# EAGLE design haptic-extender (EAGLE 5.12)
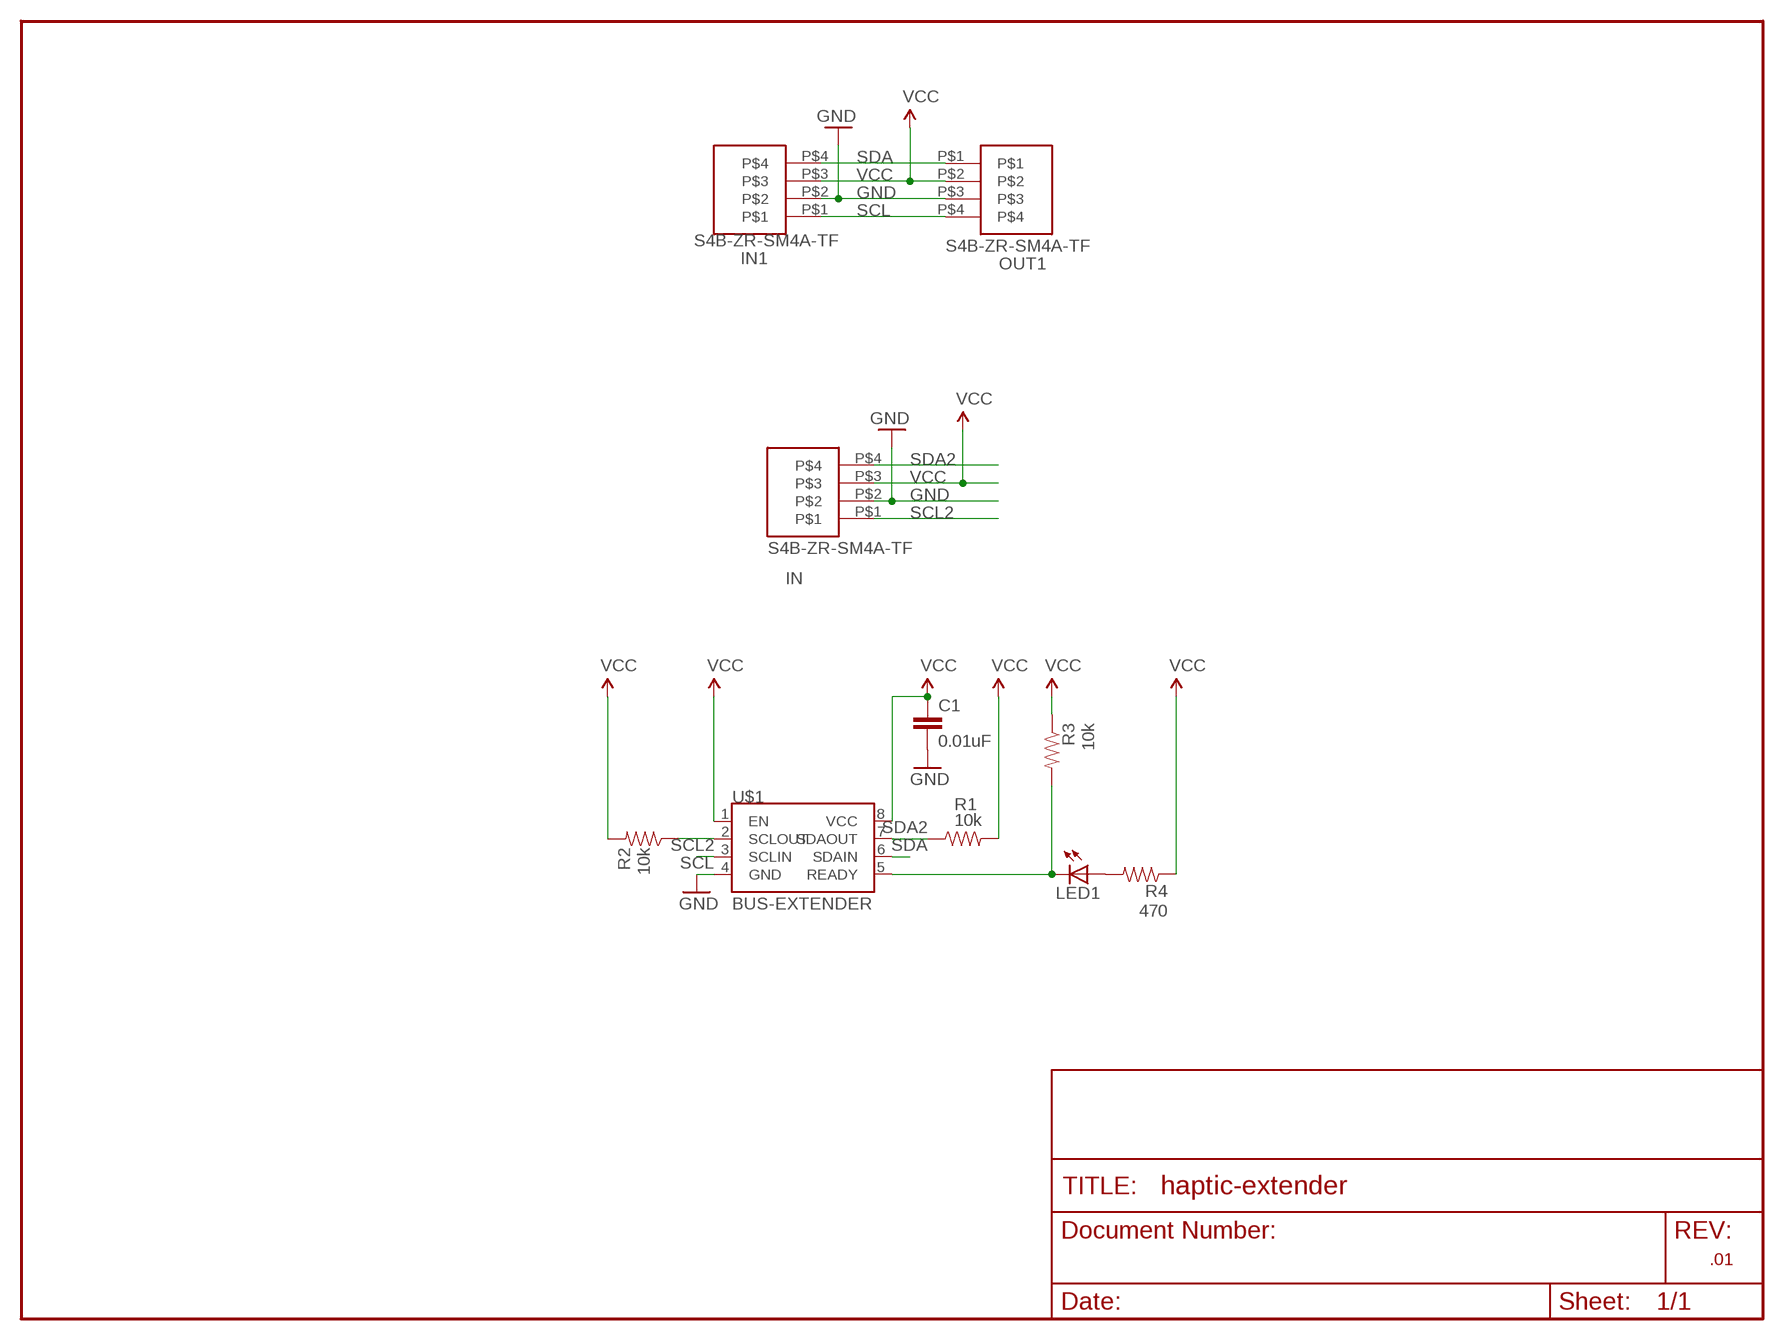
[diagram p0: schematic, sheet 1]

## Parts
C1  0.01uF  CAP0805  [0805]
IN  S4B-ZR-SM4A-TF  [S4B-ZR-SM4A-TF]
IN1  S4B-ZR-SM4A-TF  [S4B-ZR-SM4A-TF]
LED1  LEDCHIP-LED0805  [CHIP-LED0805]
OUT1  S4B-ZR-SM4A-TF  [S4B-ZR-SM4A-TF]
R1  10k  RESISTOR0805-RES  [0805]
R2  10k  RESISTOR0805-RES  [0805]
R3  10k  RESISTOR0805-RES  [0805]
R4  470  RESISTOR0805-RES  [0805]
U$1  BUS-EXTENDER  [SO08]

## Nets
GND [bus]: C1.2 IN1.P$2 IN.P$2 OUT1.P$3 U$1.4(GND)
N$1: LED1.C R3.2 U$1.5(READY)
N$2: LED1.A R4.2
SCL [bus]: IN1.P$1 OUT1.P$4 U$1.3(SCLIN)
SCL2: IN.P$1 R2.1 U$1.2(SCLOUT)
SDA [bus]: IN1.P$4 OUT1.P$1 U$1.6(SDAIN)
SDA2: IN.P$4 R1.1 U$1.7(SDAOUT)
VCC [bus]: C1.1 IN1.P$3 IN.P$3 OUT1.P$2 R1.2 R2.2 R3.1 R4.1 U$1.1(EN) U$1.8(VCC)

## Notes on the sheet
- .01

## Library data of the parts
C1 = SparkFun:CAP: Capacitor Standard 0603 ceramic capacitor, and 0.1" leaded capacitor.
IN IN1 OUT1 = cubic:S4B-ZR-SM4A-TF: B4B-ZR-SM4-TF JST ZH 4pin side entry solder tab
LED1 = led:LED: LED OSRAM: - CHIPLED LG R971, LG N971, LY N971, LG Q971, LY Q971, LO R971, LY R971 LH N974, LH R974 LS Q976, LO Q976, LY Q976 LO Q996 - Hyper CHIPLED LW Q18S LB Q993, LB Q99A, LB R99A - SideLED LS A670, LO A670, LY A670, LG A670, LP A670 LB A673, LV A673, LT A673, LW A673 LH A674 LY A675 LS A676, LA A676, LO A676, LY A676, LW A676 LS A679, LY A679, LG A679 - Hyper Micro SIDELED® LS Y876, LA Y876, LO Y876, LY Y876 LT Y87S - SmartLED LW L88C, LW L88S LB L89C, LB L89S, LG L890 LS L89K, LO L89K, LY L89K LS L896, LA L896, LO L896, LY L896 - TOPLED LS T670, LO T670, LY T670, LG T670, LP T670 LSG T670, LSP T670, LSY T670, LOP T670, LYG T670 LG T671, LOG T671, LSG T671 LB T673, LV T673, LT T673, LW T673 LH T674 LS T676, LA T676, LO T676, LY T676, LB T676, LH T676, LSB T676, LW T676 LB T67C, LV T67C, LT T67C, LS T67K, LO T67K, LY T67K, LW E67C LS E67B, LA E67B, LO E67B, LY E67B, LB E67C, LV E67C, LT E67C LW T67C LS T679, LY T679, LG T679 LS T770, LO T770, LY T770, LG T770, LP T770 LB T773, LV T773, LT T773, LW T773 LH T774 LS E675, LA E675, LY E675, LS T675 LS T776, LA T776, LO T776, LY T776, LB T776 LHGB T686 LT T68C, LB T68C - Hyper Mini TOPLED® LB M676 - Mini TOPLED Santana® LG M470 LS M47K, LO M47K, LY M47K Source: http://www.osram.convergy.de LUXEON: - LUMILED® LXK2-PW12-R00, LXK2-PW12-S00, LXK2-PW14-U00, LXK2-PW14-V00 LXK2-PM12-R00, LXK2-PM12-S00, LXK2-PM14-U00 LXK2-PE12-Q00, LXK2-PE12-R00, LXK2-PE12-S00, LXK2-PE14-T00, LXK2-PE14-U00 LXK2-PB12-K00, LXK2-PB12-L00, LXK2-PB12-M00, LXK2-PB14-N00, LXK2-PB14-P00, LXK2-PB14-Q00 LXK2-PR12-L00, LXK2-PR12-M00, LXK2-PR14-Q00, LXK2-PR14-R00 LXK2-PD12-Q00, LXK2-PD12-R00, LXK2-PD12-S00 LXK2-PH12-R00, LXK2-PH12-S00 LXK2-PL12-P00, LXK2-PL12-Q00, LXK2-PL12-R00 Source: www.luxeon.com KINGBRIGHT: KA-3528ASYC Source: www.kingbright.com
R1-R4 = SparkFun:RESISTOR: Resistor Basic schematic elements and footprints for 0603, 1206, and PTH resistors.
U$1 = jjr:BUS-EXTENDER: I2c Bus extender based on TCA4311A

## Net classes
1 bus: width 0.406 mm, drill 0.406 mm

## Board
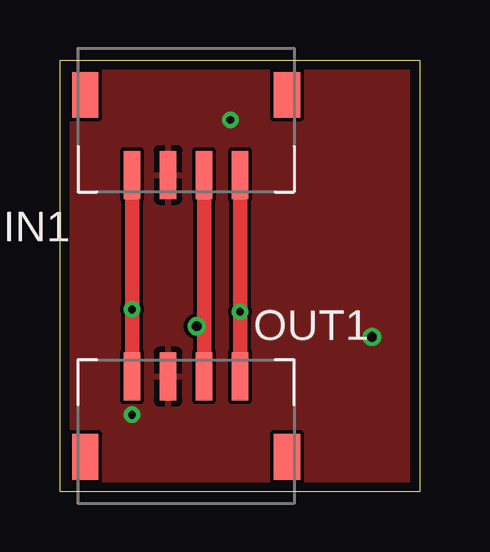
[diagram p1: board, top side]
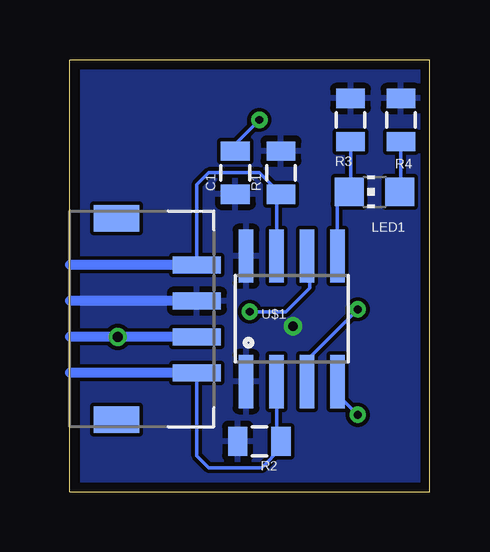
[diagram p2: board, bottom side, seen from below]

Size 15 x 18 mm. Coordinates in mm from the lower left corner, seen from the top.
Outline: 15,0 0,0 0,18 15,18 15,0
Copper layers (1*16): Top 0.0356mm / dielectric 1.5011mm / Bottom 0.0356mm
Design rules "LaenPCBOrder": minimum track width 6mil, minimum drill 13mil, track to track 6mil, track to pad 6mil, pad to pad 6mil, via to via 6mil, smd to smd 6mil, copper to edge 15mil, drill to drill 6mil, minimum pad ring 7mil, minimum via ring 7mil, stop-mask expansion 4mil, vias tented up to drill 0mil, thermal gap 10mil

### Footprints (pad centres in the part's own frame; a part is rotated, then mirrored left to right if it is on the bottom)
0805 = smd 0.8 x 1.2: 1 -0.9,0; 2 0.9,0
S4B-ZR-SM4A-TF = smd 0.7 x 2: P$1 -2.25,-2.3; P$2 -0.75,-2.3; P$3 0.75,-2.3; P$4 2.25,-2.3 | smd 1.1 x 1.9: P$5 -4.2,1.05; P$6 4.2,1.05
CHIP-LED0805 = smd 1.2 x 1.2: A 0,-1.05; C 0,1.05
SO08 = smd 0.61 x 2.21: 1 -1.905,-2.616; 2 -0.635,-2.616; 3 0.635,-2.616; 4 1.905,-2.616; 5 1.905,2.616; 6 0.635,2.616; 7 -0.635,2.616; 8 -1.905,2.616

### Placement (x,y rotation side)
C1  8.1,13.3 90 bottom
IN  12,7.2 90 bottom
IN1  5.25,15.5 0 top
LED1  2.3,12.5 90 bottom
OUT1  5.25,2.5 180 top
R1  6.2,13.3 90 bottom
R2  7.1,2.1 180 bottom
R3  3.3,15.5 270 bottom
R4  1.2,15.5 270 bottom
U$1  5.75,7.2 0 bottom

### Tracks (layer width: path | path; a pad name or v marks a point on that pad's centre or on a via)
GND  (via drill 0.33, 0.41)
  Top 0.406: OUT1.P$3 4.4,4.5
  Bottom 0.152: C1.2 8.1,14.5 v7.1,15.5 | 3.8,4.5 3.8,4 v3,3.2
  Bottom 0.406: U$1.4 3.8,4.5 | 15,6.45 v13,6.45 IN.P$2 10,6.5
  pour Top: 0,18 14.5,18 14.5,0 0,0
N$1
  Bottom 0.152: U$1.5 3.85,12 | 3.85,12 3.85,12.01 | R3.2 3.3,12.5 LED1.C 3.4,12.5 3.9,12 3.85,12
N$2
  Bottom 0.152: R4.2 1.2,12.55 LED1.A
SCL  (via drill 0.33)
  Top 0.61: IN1.P$1 v3,7.6 OUT1.P$4
  Bottom 0.152: 5.1,5.3 5.1,5.5 v3,7.6 | 5.1,5.3 5.12,5.29 | 5.1,5.3 5.1,4.6
  Bottom 0.406: 5.1,4.6 U$1.3
SCL2
  Bottom 0.152: 6.38,4.62 U$1.2 6.38,2.02 R2.1 6.2,1.8 7,1 9.2,1 9.7,1.5 IN.P$1
  Bottom 0.406: IN.P$1 15,4.95
SDA  (via drill 0.33)
  Top 0.61: OUT1.P$1 v7.5,7.5 IN1.P$4
  Bottom 0.152: U$1.6 5,9.7 5,8.5 6,7.5 v7.5,7.5
SDA2
  Bottom 0.152: U$1.7 6.38,12.21 R1.1 7.1,13.3 9.2,13.3 9.7,12.8 IN.P$4
  Bottom 0.406: IN.P$4 15,9.45
VCC  (via drill 0.41)
  Top 0.406: 6,6.9 v5.7,6.9
  Top 0.61: OUT1.P$2 6,6.9 IN1.P$3
  Bottom 0.406: IN.P$3 15,7.95
  pour Bottom: 0,18 14.5,18 14.5,0 0,0

### Text on the board
_tNames: IN | CUbiC | 4/16/2013 | rev .01 | Extender | OUT
_bNames: R4 | R3 | R1 | C1 | LED1 | U$1 | R2